# EasyEDA schematic SCH_Personal-Card_2024-08-31.json
TITLE: Sheet_1; REV: 1.0; Date: 2024-08-31; Sheet: 1/1; Drawn By: Felix Pfannkuch; Company: Your Company
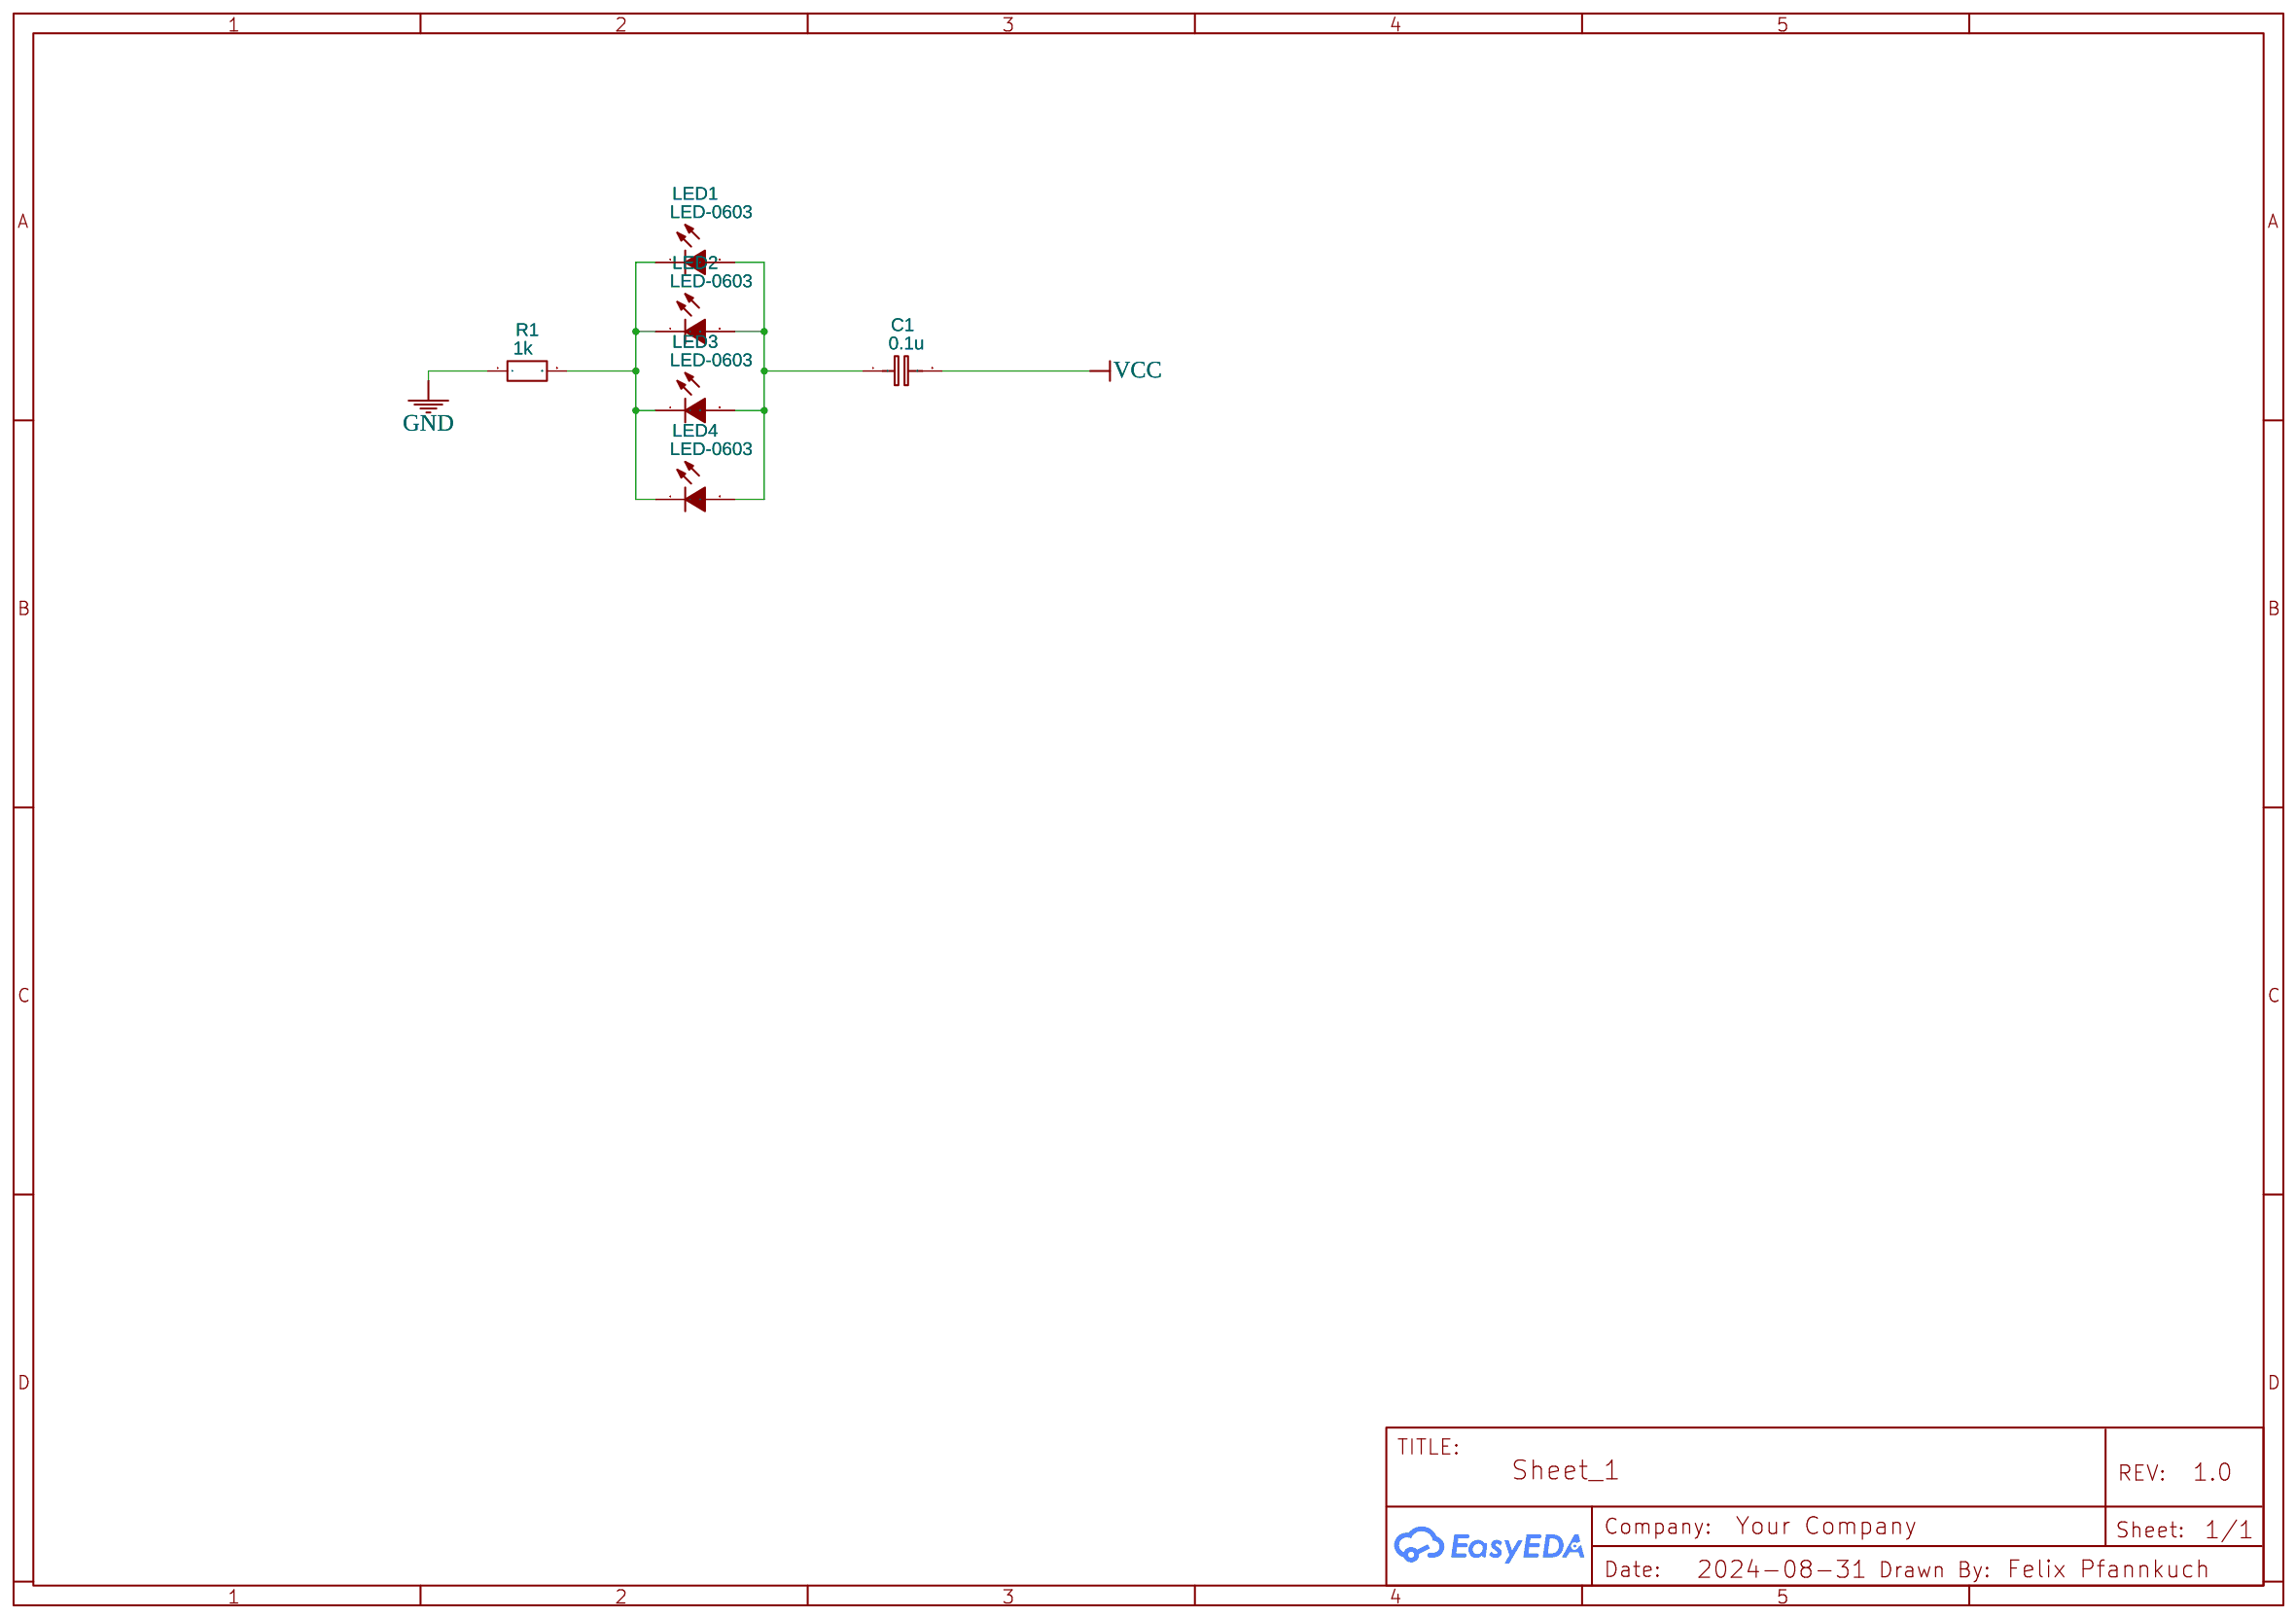
[diagram p0: schematic sheet]

## Parts
C1  0.1u  [C0603]
LED1  LED-0603  [LED0603-RD]
LED2  LED-0603  [LED0603-RD]
LED3  LED-0603  [LED0603-RD]
LED4  LED-0603  [LED0603-RD]
R1  1k  [R0603]

## Library data of the parts
C1 = C_0603_EU: Contributor: LCEDA_Lib
LED1-LED4 = LED-0603: Contributor: lcsc; Supplier: LCSC; Supplier Part: C9900020572; Manufacturer: null; JLCPCB Part Class: Extended Part
R1 = R_0603_EU: Contributor: LCEDA_Lib

## Nets
GND: R1.1
VCC: C1.2
Net-(C1-1): C1.1 LED1.2(+) LED2.2(+) LED3.2(+) LED4.2(+)
Net-(LED1-1): LED1.1(-) LED2.1(-) LED3.1(-) LED4.1(-) R1.2
